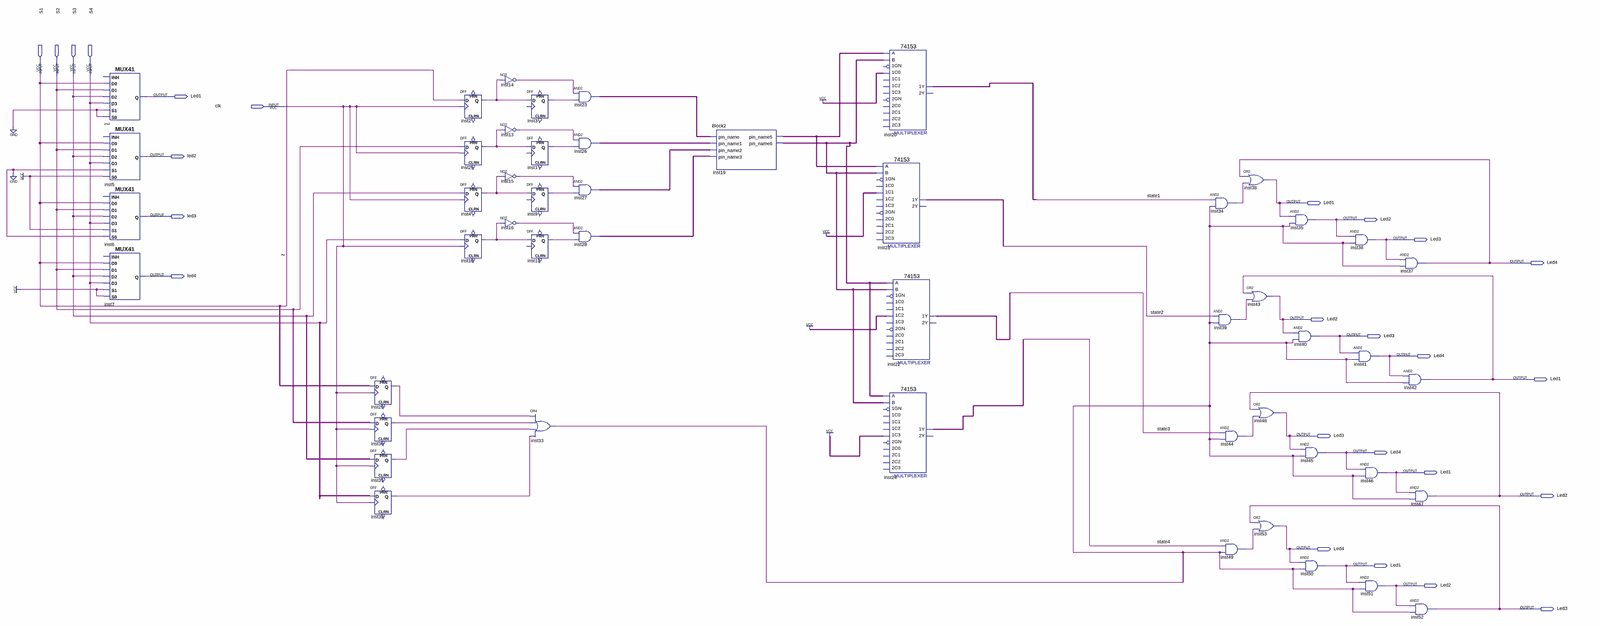
[diagram p0: schematic sheet, whole]
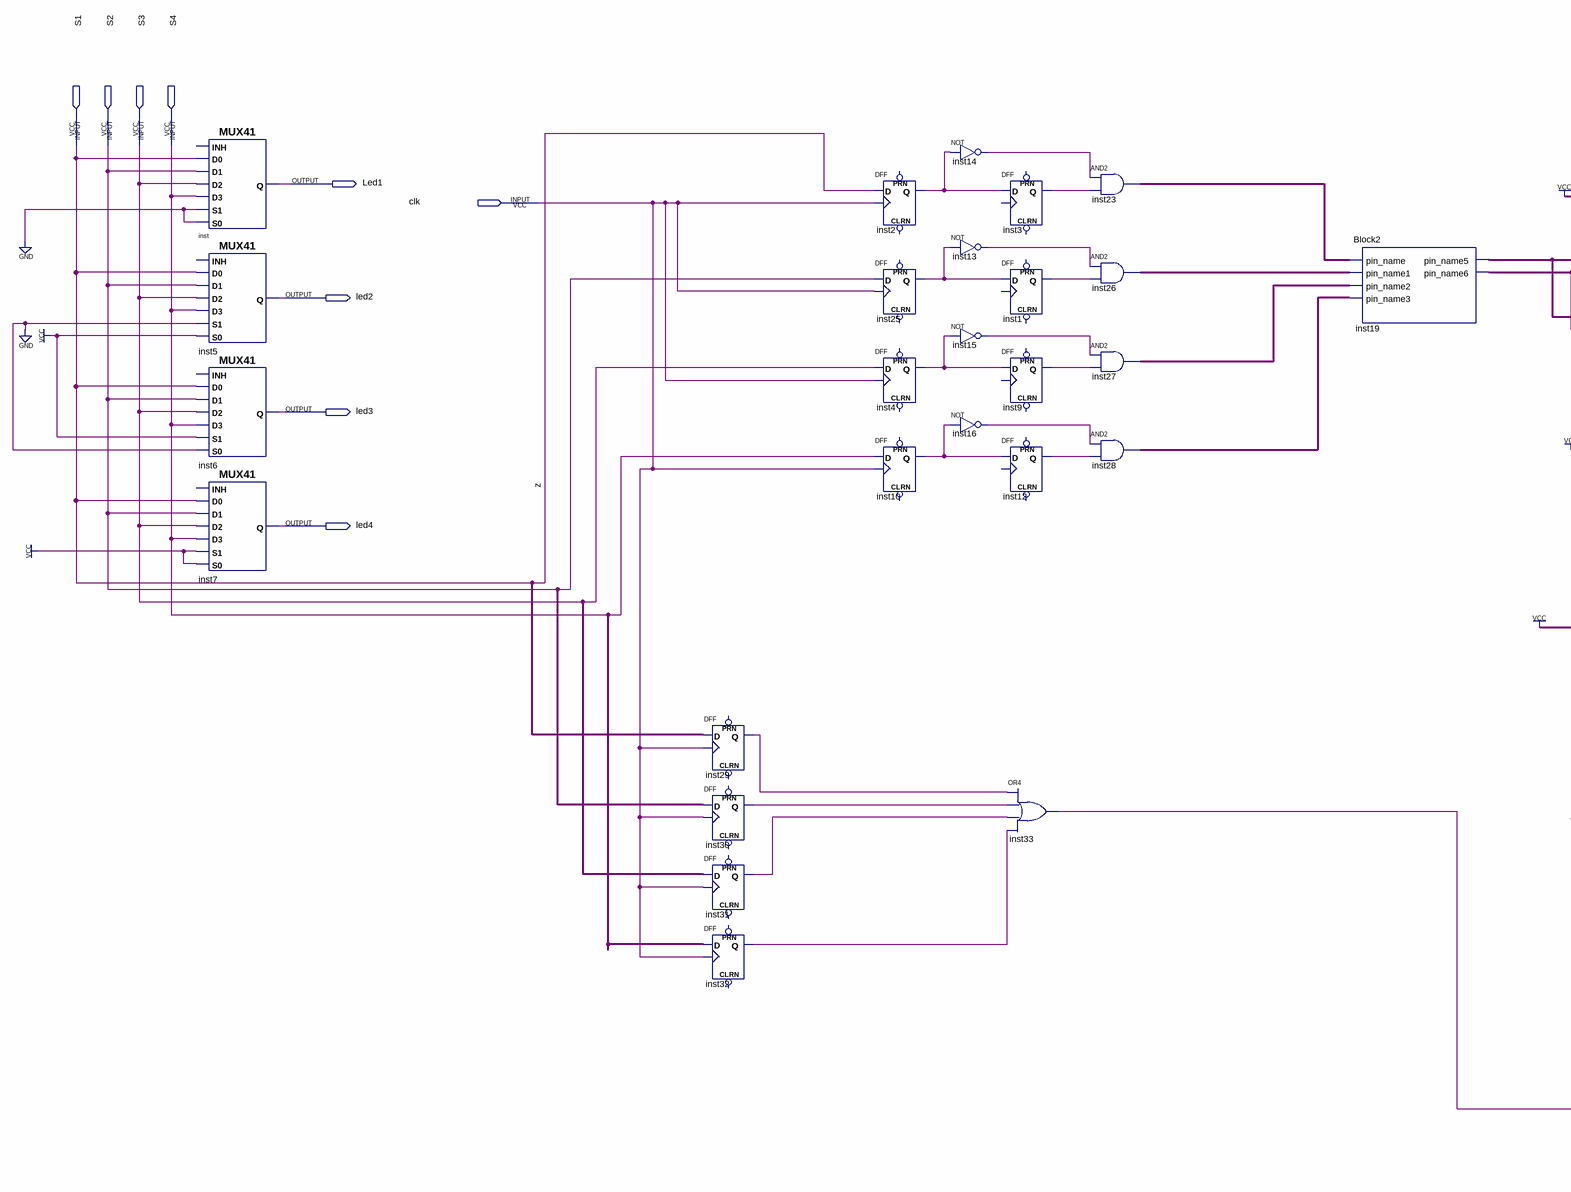
[diagram p1: schematic sheet, left part]
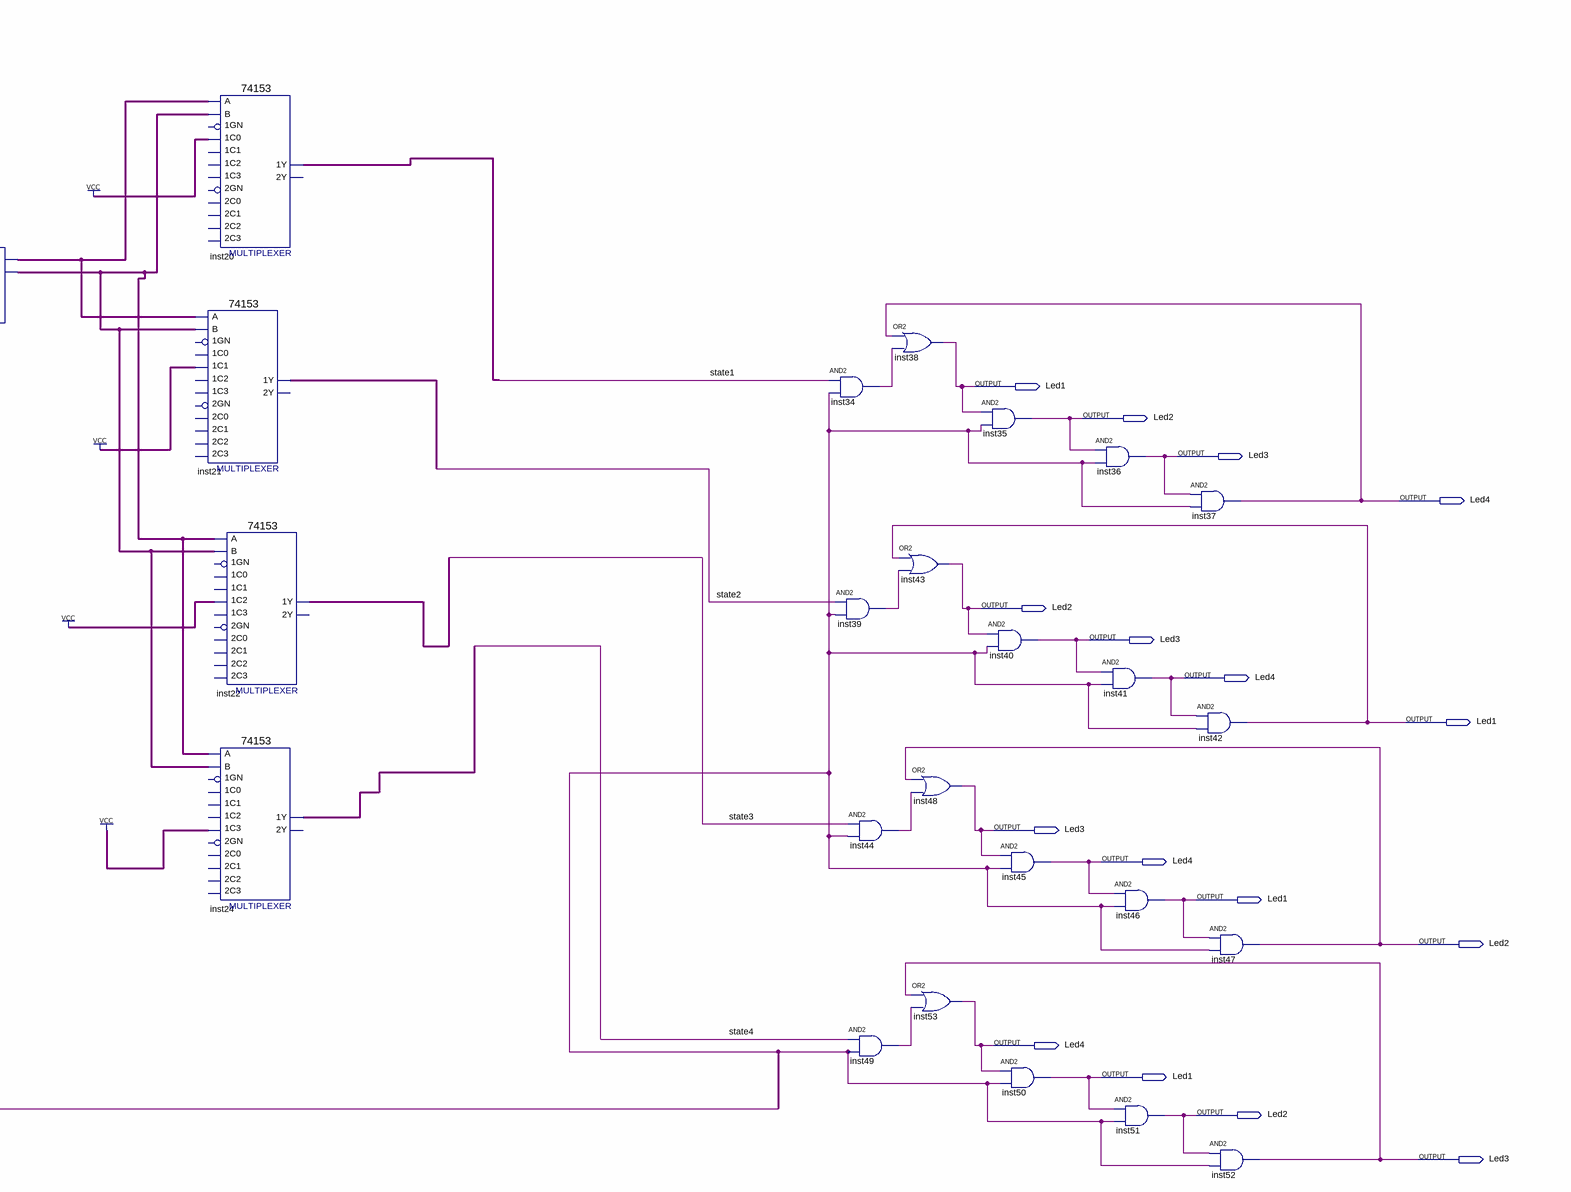
[diagram p2: schematic sheet, right part]
// Quartus schematic Project.bdf as structural Verilog: 50 symbols, 25 pins
module Project (
  input  S1,
  input  S2,
  input  S3,
  input  S4,
  input  clk,
  output Led1,
  output led2,
  output led3,
  output led4
);

  wire inst1_q, inst2_q, inst3_q, inst4_q, inst9_q, inst10_q, inst12_q, inst13_out, inst14_out, inst15_out,
       inst16_out, inst19_pin_name5, inst19_pin_name6, inst20_1y, inst21_1y, inst22_1y, inst23_out,
       inst24_1y, inst25_q, inst26_out, inst27_out, inst28_out, inst29_q, inst30_q, inst31_q, inst32_q,
       inst33_out, inst34_out, inst39_out, inst44_out, inst49_out, state1, state2, state3, state4, undriven,
       undriven_2, undriven_3, undriven_4, z;

  MUX41 inst (.S0(1'b0), .D2(S3), .S1(1'b0), .D3(S4), .D0(S1), .D1(S2), .Q(Led1));  // open: INH
  MUX41 inst5 (.S0(1'b1), .D2(S3), .S1(1'b0), .D3(S4), .D0(S1), .D1(S2), .Q(led2));  // open: INH
  MUX41 inst6 (.S0(1'b0), .D2(S3), .S1(1'b1), .D3(S4), .D0(S1), .D1(S2), .Q(led3));  // open: INH
  MUX41 inst7 (.S0(1'b1), .D2(S3), .S1(1'b1), .D3(S4), .D0(S1), .D1(S2), .Q(led4));  // open: INH
  DFF inst29 (.CLK(clk), .D(undriven), .Q(inst29_q));  // open: CLRN, PRN
  DFF inst30 (.CLK(clk), .D(undriven_2), .Q(inst30_q));  // open: CLRN, PRN
  DFF inst31 (.CLK(clk), .D(undriven_3), .Q(inst31_q));  // open: CLRN, PRN
  DFF inst32 (.CLK(clk), .D(undriven_4), .Q(inst32_q));  // open: CLRN, PRN
  DFF inst2 (.CLK(clk), .D(z), .Q(inst2_q));  // open: CLRN, PRN
  DFF inst25 (.CLK(clk), .D(S2), .Q(inst25_q));  // open: CLRN, PRN
  DFF inst4 (.CLK(clk), .D(S3), .Q(inst4_q));  // open: CLRN, PRN
  DFF inst10 (.CLK(clk), .D(S4), .Q(inst10_q));  // open: CLRN, PRN
  not inst14 (inst14_out, inst2_q);
  not inst13 (inst13_out, inst25_q);
  not inst15 (inst15_out, inst4_q);
  not inst16 (inst16_out, inst10_q);
  DFF inst3 (.D(inst2_q), .Q(inst3_q));  // open: CLRN, CLK, PRN
  DFF inst1 (.D(inst25_q), .Q(inst1_q));  // open: CLRN, CLK, PRN
  DFF inst9 (.D(inst4_q), .Q(inst9_q));  // open: CLRN, CLK, PRN
  DFF inst12 (.D(inst10_q), .Q(inst12_q));  // open: CLRN, CLK, PRN
  or inst33 (inst33_out, inst29_q, inst30_q, inst31_q, inst32_q);
  and inst23 (inst23_out, inst14_out, inst3_q);
  and inst26 (inst26_out, inst13_out, inst1_q);
  and inst27 (inst27_out, inst15_out, inst9_q);
  and inst28 (inst28_out, inst16_out, inst12_q);
  Block2 inst19 (
    .pin_name(inst23_out), .pin_name1(inst26_out), .pin_name2(inst27_out), .pin_name3(inst28_out),
    .pin_name5(inst19_pin_name5), .pin_name6(inst19_pin_name6));
  \74153  inst20 (
    .\1C0 (1'b1), .B(inst19_pin_name6), .A(inst19_pin_name5), .\1Y (inst20_1y));  // open: 1C1, 1GN, 2C0, 2GN, 2C2, 1C2, 1C3, 2C1, 2C3, 2Y
  \74153  inst21 (
    .\1C1 (1'b1), .B(inst19_pin_name6), .A(inst19_pin_name5), .\1Y (inst21_1y));  // open: 1GN, 1C0, 2C0, 2GN, 2C2, 1C2, 1C3, 2C1, 2C3, 2Y
  \74153  inst22 (
    .\1C2 (1'b1), .B(inst19_pin_name6), .A(inst19_pin_name6), .\1Y (inst22_1y));  // open: 1C1, 1GN, 1C0, 2C0, 2GN, 2C2, 1C3, 2C1, 2C3, 2Y
  \74153  inst24 (
    .\1C3 (1'b1), .B(inst19_pin_name6), .A(inst19_pin_name6), .\1Y (inst24_1y));  // open: 1C1, 1GN, 1C0, 2C0, 2GN, 2C2, 1C2, 2C1, 2C3, 2Y
  and inst34 (inst34_out, state1, inst33_out);
  and inst39 (inst39_out, state2, inst33_out);
  or inst38 (Led1, led4, inst34_out);
  and inst44 (inst44_out, state3, inst33_out);
  and inst49 (inst49_out, state4, inst33_out);
  or inst43 (led2, Led1, inst39_out);
  or inst48 (led3, led2, inst44_out);
  or inst53 (led4, led3, inst49_out);
  and inst35 (led2, Led1, inst33_out);
  and inst40 (led3, led2, inst33_out);
  and inst45 (led4, led3, inst33_out);
  and inst50 (Led1, led4, inst33_out);
  and inst36 (led3, led2, inst33_out);
  and inst41 (led4, led3, inst33_out);
  and inst46 (Led1, led4, inst33_out);
  and inst51 (led2, Led1, inst33_out);
  and inst37 (led4, led3, inst33_out);
  and inst42 (Led1, led4, inst33_out);
  and inst47 (led2, Led1, inst33_out);
  and inst52 (led3, led2, inst33_out);
endmodule
